# EAGLE design 18250^0 (EAGLE 7.6.0)
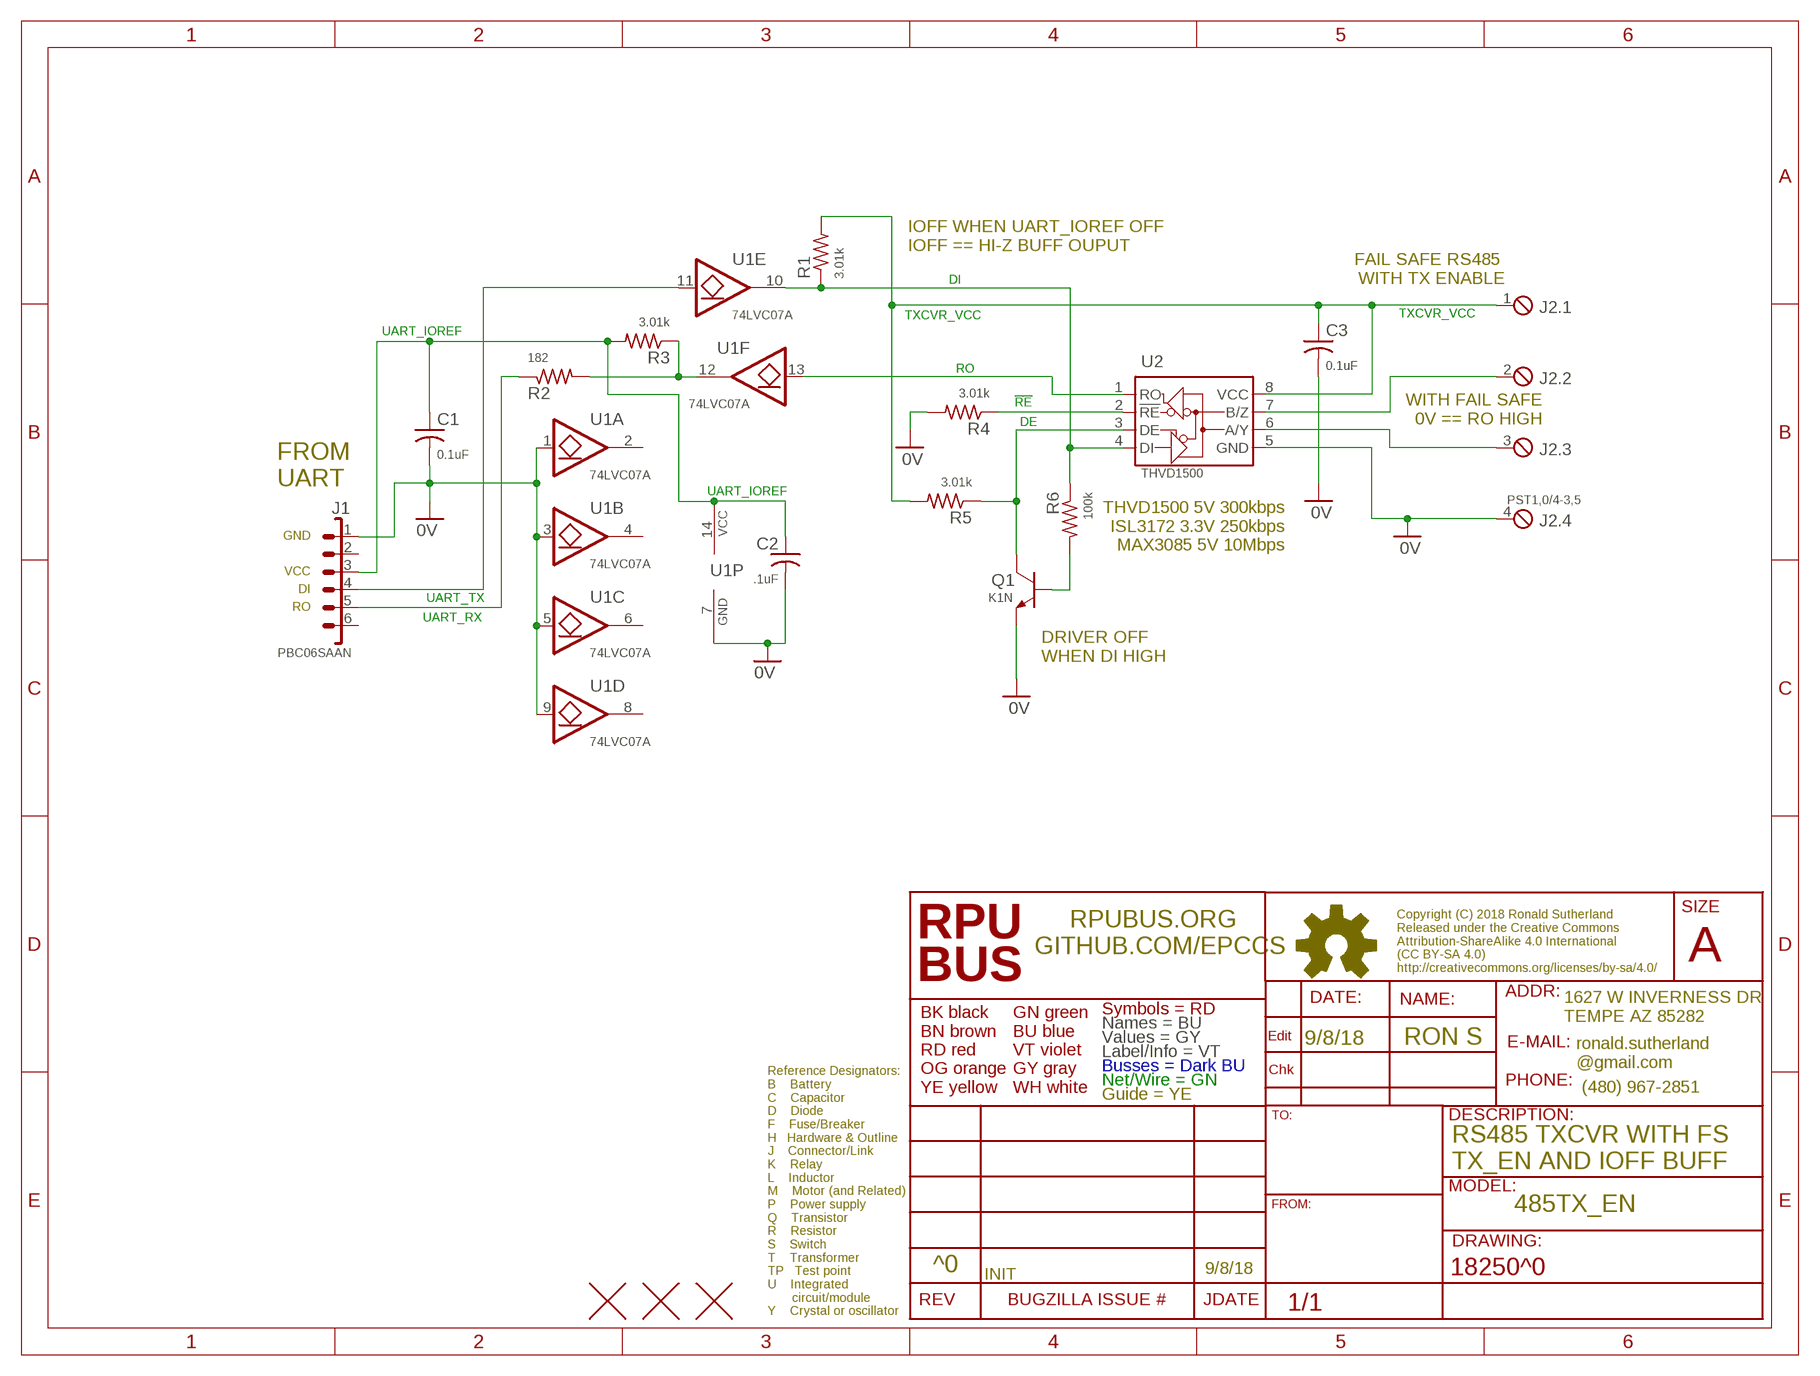
[diagram p0: schematic, sheet 1]

## Parts
C1  0.1uF  CC0603A  [C0603(1608)]
C2  .1uF  CC0603A  [C0603(1608)]
C3  0.1uF  CC0603A  [C0603(1608)]
J1  PBC06SAAN  1X6  [1X6]
J2  PST1,0/4-3,5  MCV4  [MCV4]
Q1  K1N  NPNSOT23  [SOT23]
R1  3.01k  R0805  [C0805(2012)]
R2  182  R0805  [C0805(2012)]
R3  3.01k  R0805  [C0805(2012)]
R4  3.01k  R0805  [C0805(2012)]
R5  3.01k  R0805  [C0805(2012)]
R6  100k  R0805  [C0805(2012)]
U1  74LVC07A  7407D  [14SOIC]
U2  THVD1500  ISL3172EIBZ  [SOIC8]
U$2  FIDUCIAL1.27  [FIDUCIAL-1.27]
U$3  FIDUCIAL1.27  [FIDUCIAL-1.27]
U$4  FIDUCIAL1.27  [FIDUCIAL-1.27]

## Nets
0V: C1.2 C2.2 C3.2 J1.1 J2.4 Q1.E R4.2 U1.1(A:I) U1.3(B:I) U1.5(C:I) U1.7(P:GND) U1.9(D:I) U2.5(GND)
!RE: R4.1 U2.2(!RE)
A: J2.3 U2.6(A/Y)
B: J2.2 U2.7(B/Z)
DE: Q1.C R5.1 U2.3(DE)
DI: R1.1 R6.1 U1.10(E:O) U2.4(DI)
N$1: R2.2 R3.1 U1.12(F:O)
N$25: Q1.B R6.2
RO: U1.13(F:I) U2.1(RO)
TXCVR_VCC: C3.1 J2.1 R1.2 R5.2 U2.8(VCC)
UART_IOREF: C1.1 C2.1 J1.3 R3.2 U1.14(P:VCC)
UART_RX: J1.5 R2.1
UART_TX: J1.4 U1.11(E:I)
Unconnected: J1.2 J1.6 U1.2(A:O) U1.4(B:O) U1.6(C:O) U1.8(D:O)

## Notes on the sheet
- IOFF WHEN UART_IOREF OFF
  IOFF == HI-Z BUFF OUPUT
- FAIL SAFE RS485 
  WITH TX ENABLE
- WITH FAIL SAFE
  0V == RO HIGH
- FROM 
  UART
- GND
- THVD1500 5V 300kbps
  ISL3172 3.3V 250kbps
  MAX3085 5V 10Mbps
- VCC
- DI
- RO
- DRIVER OFF
  WHEN DI HIGH
- 9/8/18 | RON S
- RS485 TXCVR WITH FS 
  TX_EN AND IOFF BUFF
- 485TX_EN
- ^0 | 9/8/18
- INIT

## Library data of the parts
C1-C3 = C-C:C: CAPACITOR Symbol
J1 = J-HDR2.54mm:1X6: 6 POS HEADER PBC06SAAN [SULLINS,PBC06SAAN]HEADER MALE BRKWAY 6POS .1IN AA
J2 = J-HDR3.5mm:MCV4: MCV 1,5/4-G-3,5-RN [PHOENIX CONTACT,1843622] CONN HEADER SHROUDED 2POS 3.5MM PST 1,0/4-3,5 [PHOENIX CONTACT,1945119] CONN HEADER STRIP PIN 4POS 3.5MM MCVR 1,5& 4-ST-3,5 [PHOENIX CONTACT,1863178] CONN PLUG 4POS SCREW 3.5MM
Q1 = Q-NPN:NPN: BJT NPN General Purpose Amplifier
R1-R6 = R-C:R: Resiistor American-style symbol
U1 = U-7400:74*07: HEX BUFFER, OPEN DRAIN/COLLECTOR 74LVC07A [DIODES,74LVC07AS14-13] LOGIC BUFFER OPEN DRAIN 14SOIC
U2 = U-Transceiver:ISL3172E: TRANSCEIVER RS485 3.3V HALFDPLX
U$2-U$4 = H-Fiducial:FIDUCIAL: Fiducial Alignment Points Various fiducial points for machine vision alignment.

## Net classes
0 default: width 0.178 mm, drill 0.33 mm

## Board
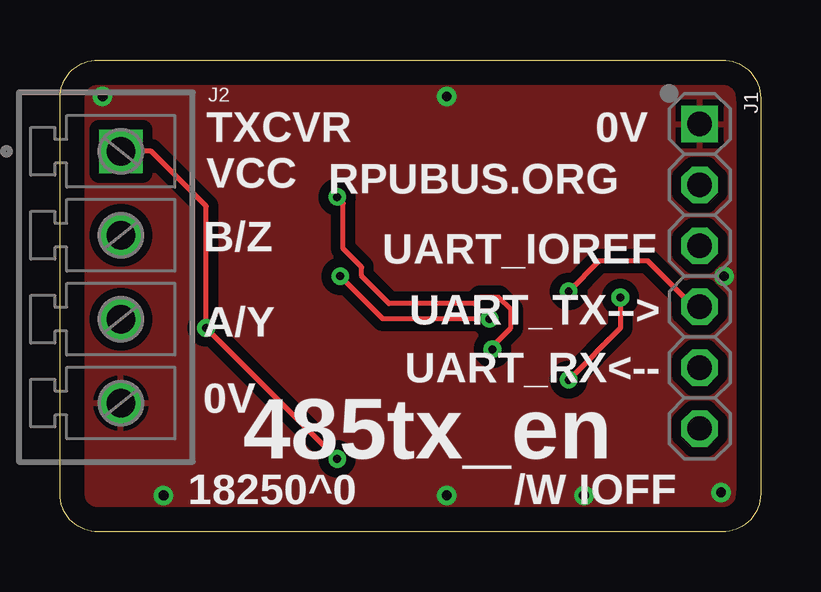
[diagram p1: board, top side]
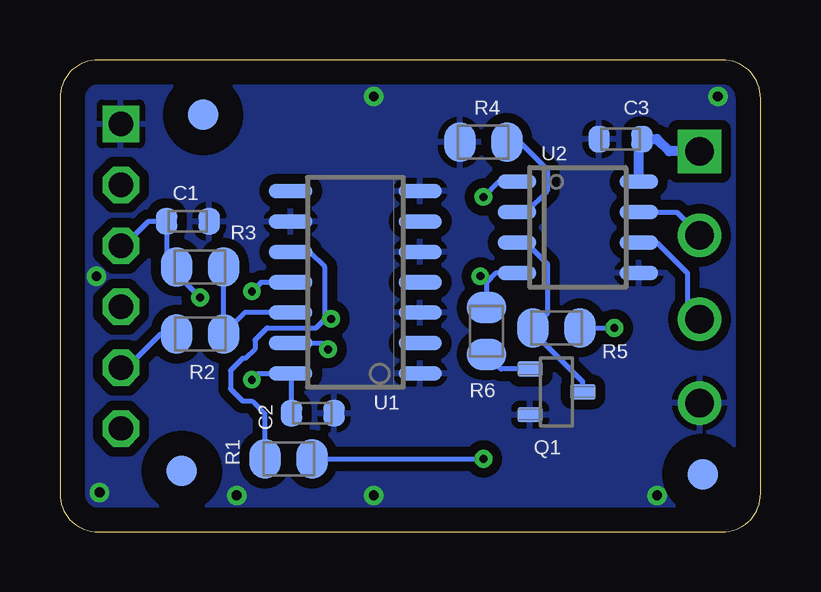
[diagram p2: board, bottom side, seen from below]

Size 29.21 x 19.68 mm. Coordinates in mm from the lower left corner, seen from the top.
Outline: 29.21,18.1 29.21,1.59 arc-90 27.62,0 1.59,0 arc-90 0,1.59 0,18.1 arc-90 1.59,19.68 27.62,19.68 arc-90 29.21,18.1
Copper layers (1*16): Top 0.034290625mm / dielectric 60mil / Bottom 0.034290625mm
Design rules "default *": minimum track width 10mil, minimum drill 13mil, track to track 8mil, track to pad 8mil, pad to pad 8mil, via to via 8mil, smd to smd 8mil, copper to edge 40mil, drill to drill 12mil, minimum pad ring 10mil, minimum via ring 8mil, stop-mask expansion 4mil, vias tented up to drill 17mil, thermal gap 10mil

### Footprints (pad centres in the part's own frame; a part is rotated, then mirrored left to right if it is on the bottom)
C0603(1608) = smd 0.898 x 1.1: 1 -0.889,0; 2 0.889,0
1X6 = drill 1.016 square: 1 0,0 | drill 1.016 octagon: 2 2.54,0; 3 5.08,0; 4 7.62,0; 5 10.16,0; 6 12.7,0
MCV4 = drill 1.2 square: 1 0,0 | drill 1.2: 2 3.5,0; 3 7,0; 4 10.5,0
SOT23 = smd 0.65 x 1.06: B -0.95,-1.1; C 0,1.1; E 0.95,-1.1
C0805(2012) = smd 1.321 x 1.651: 1 -0.977,0; 2 0.977,0
14SOIC = smd 0.6 x 1.8: 1 -3.81,-2.7; 2 -2.54,-2.7; 3 -1.27,-2.7; 4 0,-2.7; 5 1.27,-2.7; 6 2.54,-2.7; 7 3.81,-2.7; 8 3.81,2.7; 9 2.54,2.7; 10 1.27,2.7; 11 0,2.7; 12 -1.27,2.7; 13 -2.54,2.7; 14 -3.81,2.7
SOIC8 = smd 0.6 x 1.6: 1 -1.905,-2.54; 2 -0.635,-2.54; 3 0.635,-2.54; 4 1.905,-2.54; 5 1.905,2.54; 6 0.635,2.54; 7 -0.635,2.54; 8 -1.905,2.54
FIDUCIAL-1.27 = smd 1.27 x 1.27: 1 0,0

### Placement (x,y rotation side)
C1  23.88,12.95 0 bottom
C2  18.67,4.95 0 bottom
C3  5.84,16.38 180 bottom
J1  26.67,17.02 270 top
J2  2.54,15.88 270 top
Q1  8.51,5.84 270 bottom
R1  19.68,3.05 0 bottom
R2  23.37,8.26 0 bottom
R3  23.37,11.05 180 bottom
R4  11.56,16.26 180 bottom
R5  8.51,8.51 0 bottom
R6  11.43,8.38 270 bottom
U1  16.89,10.41 90 bottom
U2  7.62,12.7 270 bottom
U$2  23.24,17.4 0 bottom
U$3  2.41,2.41 0 bottom
U$4  24.13,2.54 0 bottom

### Tracks (layer width: path | path; a pad name or v marks a point on that pad's centre or on a via)
0V  (via drill 0.41)
  other vias: 27.69,10.67 27.56,1.65 16.13,18.16 1.78,18.16 16.13,1.52 21.84,1.52 4.32,1.52
  pour Top (isolate 0.406): 29.21,0 0,0 0,19.68 29.21,19.68
  pour Bottom (isolate 0.406): 0,19.68 29.21,19.68 29.21,0 0,0
!RE
  Bottom 0.203: R4.1 10.03,16.26 8.89,15.11 8.89,14.22 9.78,13.34 U2.2
A
  Bottom 0.203: U2.6 4.32,12.06 3.05,10.79 3.05,9.38 J2.3
B
  Bottom 0.203: U2.7 3.5,13.34 J2.2
DE
  Bottom 0.203: U2.3 9.78,12.06 8.89,11.18 8.89,9.11 R5.1 9.49,8.34 7.41,6.27 Q1.C
DI  (via drill 0.33)
  Top 0.203: v17.91,8.89 13.46,8.89 v11.68,10.67
  Bottom 0.203: R1.1 20.66,4.91 21.21,5.46 21.59,5.46 22.1,5.97 22.1,6.73 21.59,7.24 21.46,7.24 21.08,7.62 21.08,8 20.57,8.51 18.54,8.51 18.16,8.89 | 18.16,8.89 18.16,11.05 18.8,11.68 U1.10 | 18.16,8.89 v17.91,8.89 | v11.68,10.67 11.43,10.41 | 11.43,10.41 R6.1 | U2.4 11.05,10.79 11.43,10.41
N$1
  Bottom 0.203: R3.1 R2.2 21.5,9.14 U1.12
N$25
  Bottom 0.203: Q1.B 10.82,6.79 R6.2
RO  (via drill 0.33)
  Top 0.203: v18.03,7.62 18.03,7.75 18.8,8.51 18.8,9.27 18.29,9.78 17.53,9.78 17.27,9.53 13.72,9.53 12.57,10.67 12.57,11.05 11.81,11.81 11.81,13.72 v11.56,13.97
  Bottom 0.203: U1.13 18.29,7.87 v18.03,7.62 | 11.3,14.22 v11.56,13.97 10.92,14.61 U2.1
TXCVR_VCC  (via drill 0.33)
  Top 0.203: J2.1 3.81,15.88 6.1,13.59 v6.1,8.51 v11.56,3.05
  Bottom 0.203: R5.2 v6.1,8.51 | v11.56,3.05 R1.2 18.71,3.09
  Bottom 0.406: U2.8 5.08,16.26 C3.1 4.32,16.38 3.81,15.88 J2.1
UART_IOREF  (via drill 0.33)
  Top 0.203: v23.37,9.78 23.37,8.51 v21.21,6.35
  Bottom 0.203: J1.3 26.54,11.94 25.53,12.95 C1.1 24.77,11.6 R3.2 24.34,10.76 v23.37,9.78 | v21.21,6.35 20.95,6.6 U1.14 19.56,6.57 C2.1
UART_RX
  Bottom 0.203: J1.5 26.42,6.86 25.02,8.26 R2.1
UART_TX  (via drill 0.33)
  Top 0.203: J1.4 26.42,9.4 24.51,11.3 22.48,11.3 v21.21,10.03
  Bottom 0.203: v21.21,10.03 20.83,10.41 U1.11

### Text on the board
tPlace: 0V | TXCVR / VCC | RPUBUS.ORG | B/Z | UART_IOREF | UART_TX--> | A/Y | UART_RX<-- | 0V | 485tx_en | 18250^0 | /W IOFF